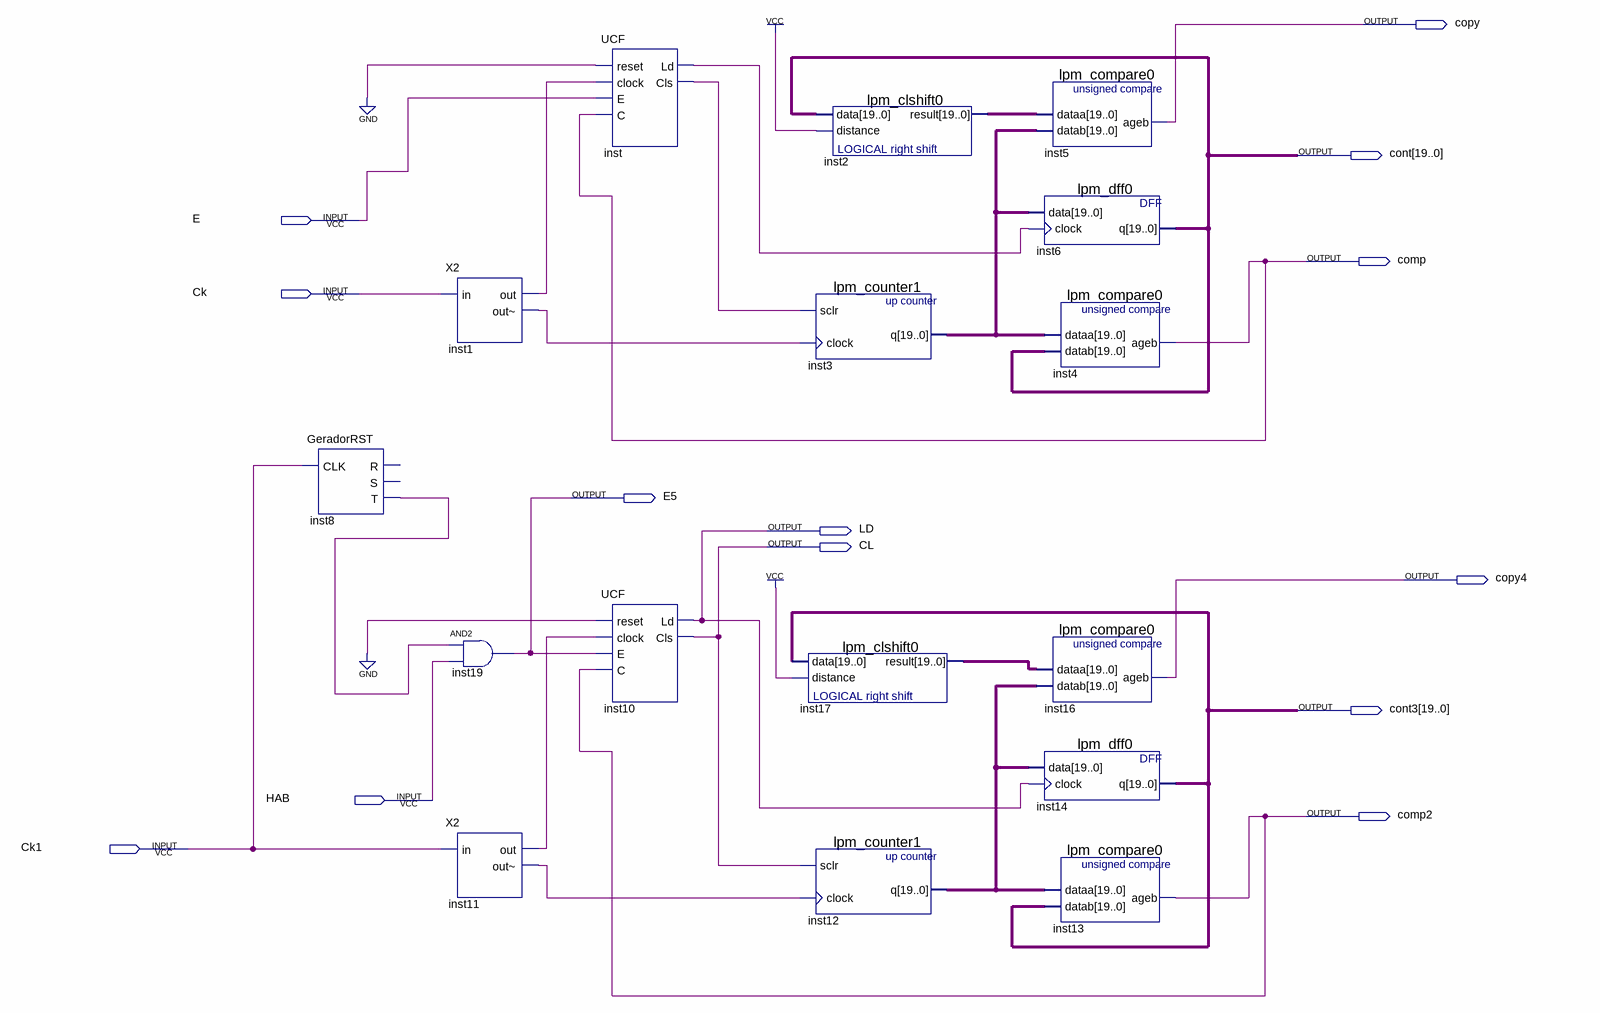
[diagram p0: schematic sheet]
// Quartus schematic Med_Per_Fase_fig17.bdf as structural Verilog: 16 symbols, 13 pins
module Med_Per_Fase_fig17 (
  input  E,
  input  Ck,
  input  HAB,
  input  Ck1,
  output copy,
  output [19:0] cont,
  output comp,
  output E5,
  output LD,
  output CL,
  output copy4,
  output [19:0] cont3,
  output comp2
);

  wire inst1_out, inst1_out_, inst8_t, inst11_out, inst11_out_, inst_cls, inst_ld;
  wire [19:0] inst2_result, inst3_q, inst12_q, inst17_result;

  GeradorRST inst8 (.CLK(Ck1), .T(inst8_t));  // open: R, S
  X2 inst1 (.in(Ck), .out(inst1_out), .\out~ (inst1_out_));
  and inst19 (E5, inst8_t, HAB);
  X2 inst11 (.in(Ck1), .out(inst11_out), .\out~ (inst11_out_));
  UCF inst (.reset(1'b0), .clock(inst1_out), .E(E), .C(comp), .Ld(inst_ld), .Cls(inst_cls));
  UCF inst10 (.reset(1'b0), .clock(inst11_out), .E(E5), .C(comp2), .Ld(LD), .Cls(CL));
  lpm_clshift0 inst2 (.data(cont), .distance(1'b1), .result(inst2_result));
  lpm_counter1 inst3 (.sclr(inst_cls), .clock(inst1_out_), .q(inst3_q));
  lpm_clshift0 inst17 (.data(cont3), .distance(1'b1), .result(inst17_result));
  lpm_counter1 inst12 (.sclr(CL), .clock(inst11_out_), .q(inst12_q));
  lpm_compare0 inst5 (.dataa(inst2_result), .datab(inst3_q), .ageb(copy));
  lpm_dff0 inst6 (.data(inst3_q), .clock(inst_ld), .q(cont));
  lpm_compare0 inst4 (.dataa(inst3_q), .datab(cont), .ageb(comp));
  lpm_compare0 inst16 (.dataa(inst17_result), .datab(inst12_q), .ageb(copy4));
  lpm_dff0 inst14 (.data(inst12_q), .clock(LD), .q(cont3));
  lpm_compare0 inst13 (.dataa(inst12_q), .datab(cont3), .ageb(comp2));
endmodule
